# Altium schematic sheet Himax.SchDoc: Himax Camera
size Letter; Author: Ali Saffari; Organization: University of Washington; Address1: Sensor Systems Lab; Revision: 2; SheetNumber: 1; SheetTotal: 1
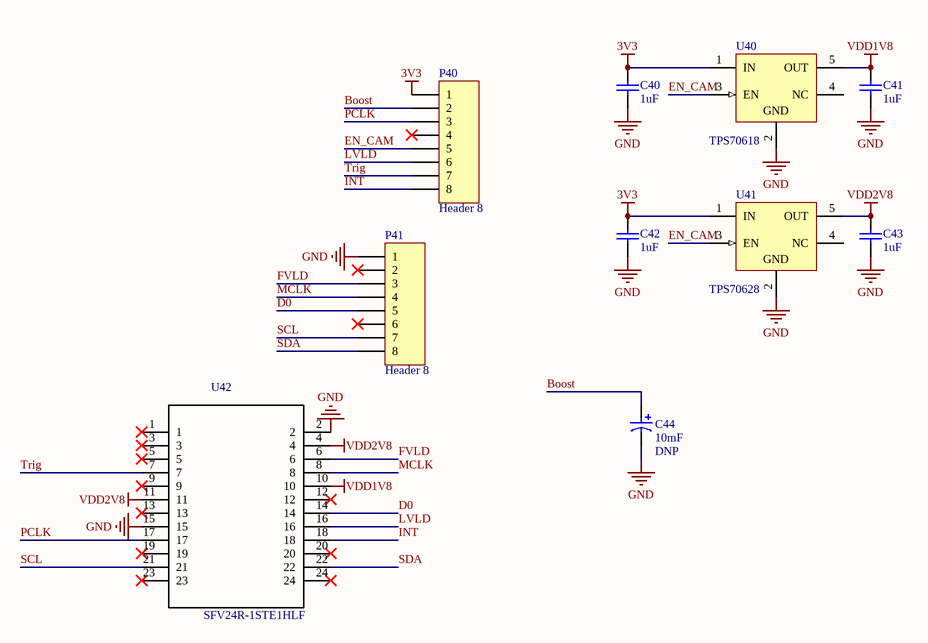
[diagram p0: Himax.SchDoc]

## Parts
C40  value 1uF  [0402]  (hidden comment: Generic ceramic capacitor)
C41  value 1uF  [0402]  (hidden comment: Generic ceramic capacitor)
C42  value 1uF  [0402]  (hidden comment: Generic ceramic capacitor)
C43  value 1uF  [0402]  (hidden comment: Generic ceramic capacitor)
C44  value DNP  Note: 10mF  [CAPPRD500W60D1000H3200]  (hidden comment: Generic electrolytic capacitor)
P40  Header 8  [HDR1X8]
P41  Header 8  [HDR1X8]
U40  TPS70618  [TI-DDC5_M]
U41  TPS70628  [TI-DDC5_M]
U42  SFV24R-1STE1HLF  [FCI_SFV24R-2STE1LF]

## Nets
3V3: C40.2 C42.2 P40.1 U40.1(IN) U41.1(IN)
GND: C40.1 C41.1 C42.1 C43.1 C44.N P41.1 U40.2(GND) U41.2(GND) U42.2 U42.15
VDD1V8: C41.2 U40.5(OUT) U42.10
VDD2V8: C43.2 U41.5(OUT) U42.4 U42.11
Boost: C44.P P40.2
D0: P41.5 U42.14
EN_CAM: P40.5 U40.3(EN) U41.3(EN)
FVLD: P41.3 U42.6
INT: P40.8 U42.18
LVLD: P40.6 U42.16
MCLK: P41.4 U42.8
PCLK: P40.3 U42.17
SCL: P41.7 U42.21
SDA: P41.8 U42.22
Trig: P40.7 U42.7

Not connected (* = marked no-connect by the designer): P40 4*; P41 2* 6*; U40 4(NC); U41 4(NC); U42 1* 3* 5* 9* 12* 13* 19* 20* 23* 24*

## Notes on the sheet
- Title
- Date:
- Project
- Revision:
- Sheet
- of
- Author:

## Library data of the parts
C40-C43 = C-1uF-10V-X5R-0402: CAP CER 1UF 10V X5R 0402; Manufacturer: Samsung Electro-Mechanics; Manufacturer Part Number: CL05A105KP5NNNC; Rating: 10V, -55~85C; Tolerance: +-10%; Digi-Key Part Number: 1276-1076-1-ND; Note: *
C44 = cap_electrolytic: Electrolytic capacitor; Digi-Key Part Number: *; Manufacturer: *; Manufacturer Part Number: *; Rating: *; Tolerance: *
P40 P41 = Header 8: Header, 8-Pin; LatestRevisionDate: 17-Jul-2002; LatestRevisionNote: Re-released for DXP Platform.; Publisher: Altium Limited
U40 = TPS706xx: Linear Voltage Regulator IC Positive Fixed 1 Output 150mA SOT-23-5; Manufacturer: Texas Instruments; Manufacturer Part Number: TPS70618DBVR; Number of Regulators: 1; Min Current Limit: 200mA; Quiescent Current: 1.3uA; Dropout Voltage: 245mV; Min Input Voltage: 2.7V; Max Input Voltage: 6.5V; Accuracy: 2%; ComponentLink3URL: http://www.ti.com/litv/pdf/mpds123d; ComponentLink1Description: Manufacturer URL; ComponentLink2URL: http://www.ti.com/general/docs/lit/getliterature.tsp?genericPartNumber=TPS78001&fileType=pdf; ComponentLink3Description: Package Specification; ComponentLink1URL: http://www.ti.com/; ComponentLink2Description: Datasheet; Mount: Surface Mount; Case/Package: SOT-23-5; Number of Pins: 5; Contact Plating: Gold; Min Operating Temperature: -40°C; Max Operating Temperature: 125°C; Packaging: Cut Tape; Output Voltage: *; Output Current: 150mA; Output Type: Fixed; Polarity: Positive; Number of Outputs: 1; Max Output Current: 150mA; Lead Free: Lead Free; REACH SVHC: No SVHC; Digi-Key Part Number: 296-47896-1-ND
U41 = TPS706xx: Linear Voltage Regulator IC Positive Fixed 1 Output 150mA SOT-23-5; Manufacturer: Texas Instruments; Manufacturer Part Number: TPS70628DBVR; Number of Regulators: 1; Min Current Limit: 200mA; Quiescent Current: 1.3uA; Dropout Voltage: 245mV; Min Input Voltage: 2.7V; Max Input Voltage: 6.5V; Accuracy: 2%; ComponentLink3URL: http://www.ti.com/litv/pdf/mpds123d; ComponentLink1Description: Manufacturer URL; ComponentLink2URL: http://www.ti.com/general/docs/lit/getliterature.tsp?genericPartNumber=TPS78001&fileType=pdf; ComponentLink3Description: Package Specification; ComponentLink1URL: http://www.ti.com/; ComponentLink2Description: Datasheet; Mount: Surface Mount; Case/Package: SOT-23-5; Number of Pins: 5; Contact Plating: Gold; Min Operating Temperature: -40°C; Max Operating Temperature: 125°C; Packaging: Cut Tape; Output Voltage: *; Output Current: 150mA; Output Type: Fixed; Polarity: Positive; Number of Outputs: 1; Max Output Current: 150mA; Lead Free: Lead Free; REACH SVHC: No SVHC; Digi-Key Part Number: 296-50141-1-ND
U42 = SFV24R-1STE1HLF: Himax Camera Connector; Manufacturer: Amphenol FCI; Actuator Material: Glass,Polyphenylene; Number of Contacts: 24; Contact Resistance: 30mR; Current Rating: 500mA; Voltage Rating: 50V; Contact Location: Bottom; Insulation Resistance: 100MR; Wire/Cable Type: Straight; Pitch: 0.5mm; Supplier 1: Digi-Key; Manufacturer Part Number: SFV24R-1STE1HLF; Stock 1: 0; Pricing 1: 1=0.76, 10=0.67, 25=0.6308, 50=0.6044, 100=0.5782, 250=0.5256, 500=0.47304, 1000=0.42048 (USD); Mount: Surface Mount; Contact Material: Bronze; Contact Plating: Tin; Housing Color: Black; Housing Material: Polymer; Min Operating Temperature: -55°C; Max Operating Temperature: 105°C; Number of Rows: 1; Termination: Solder; Orientation: Right Angle; Packaging: Tape and Reel; Package Quantity: 3000; Number of Positions: 24; Max Voltage Rating (AC): 50V; Max Voltage Rating (DC): 50V; Length: 17.5mm; Depth: 4.9mm; Radiation Hardening: No; Lead Free: Lead Free; Flammability Rating: UL94 V-0; ComponentLink1URL: http://portal.fciconnect.com/Comergent/fci/drawing/10112793.pdf?src-supplier=Avnet; ComponentLink1Description: http://portal.fciconnect.com/Comergent/fci/drawing/10112793.pdf?src-supplier=Avnet; ComponentLink2URL: https://cdn.amphenol-icc.com/media/wysiwyg/files/drawing/10112793.pdf?src-supplier=Digi-Key; ComponentLink2Description: https://cdn.amphenol-icc.com/media/wysiwyg/files/drawing/10112793.pdf?src-supplier=Digi-Key; ComponentLink3URL: http://portal.fciconnect.com/Comergent//fci/drawing/10112793.pdf?src-supplier=Mouser; ComponentLink3Description: http://portal.fciconnect.com/Comergent//fci/drawing/10112793.pdf?src-supplier=Mouser; Supplier Part Number 1: 609-4320-1-ND